# EAGLE design SensorNodeCat (EAGLE 9.6.2)
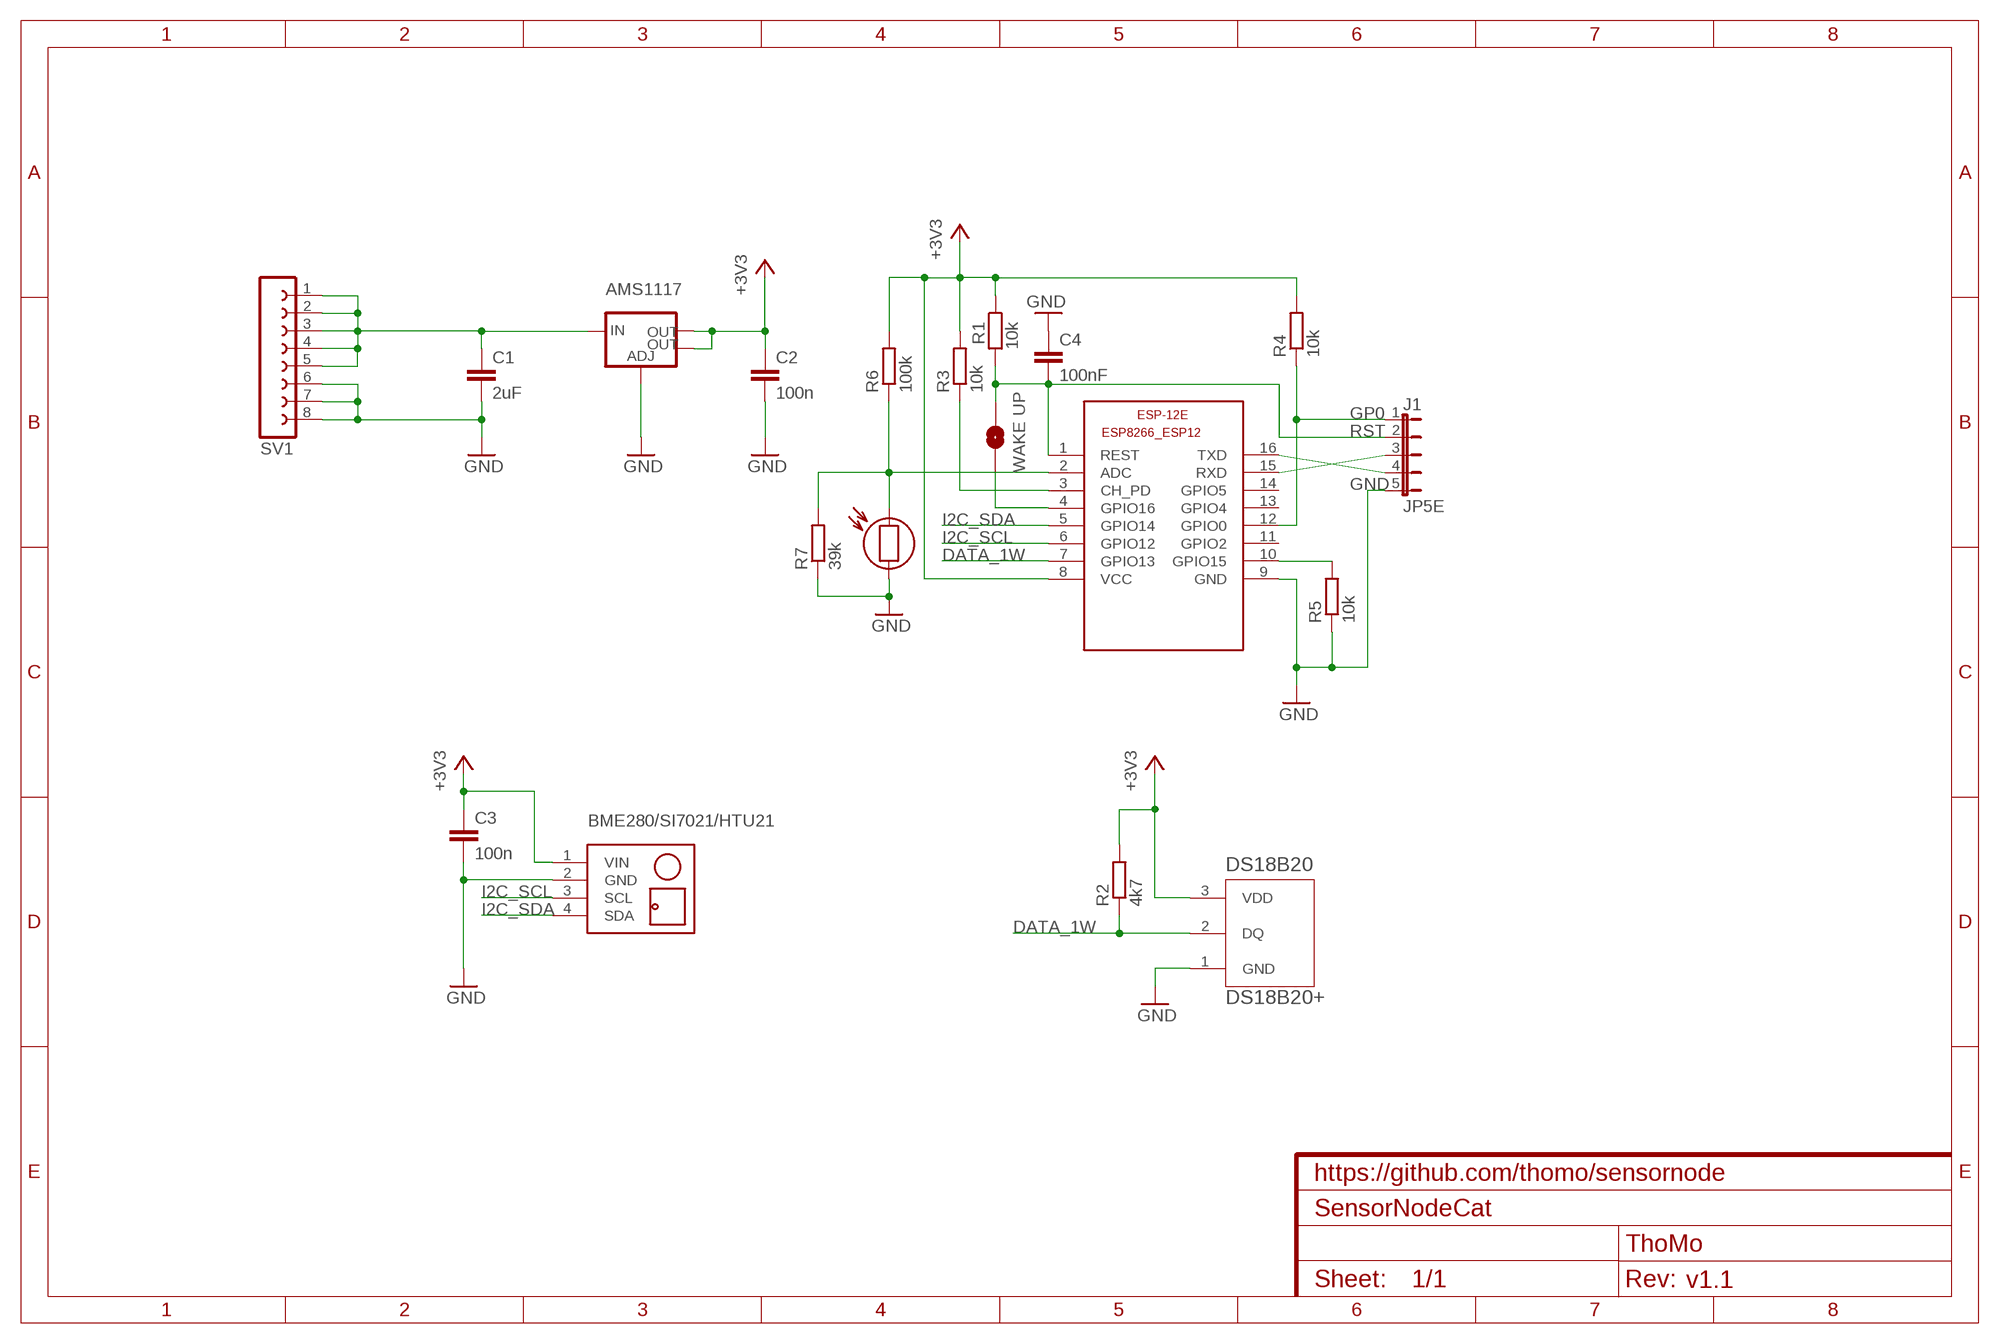
[diagram p0: schematic, sheet 1]
FRAME2 (FRAME-A4L): CNAME: https://github.com/thomo/sensornode; CREVISION: v1.1; DESIGNER: ThoMo

## Parts
AMS1117  V_REG_LM1117SOT223  [SOT223]
BME280/SI7021/HTU21  BME280  [BME280]
C1  2uF  C-EUC1206  [C1206]
C2  100n  C-EUC1206  [C1206]
C3  100n  C-EUC1206K  [C1206K]
C4  100nF  C-EUC1206  [C1206]
DS18B20  DS18B20+  [TO-92]
ESP-12E  ESP8266-12  [ESP8266-ESP12]
J1  JP5E  [JP5]
LDR  LDR-GL55XX  [GL55]
R1  10k  R-EU_M1206  [M1206]
R2  4k7  R-EU_M1206  [M1206]
R3  10k  R-EU_M1206  [M1206]
R4  10k  R-EU_M1206  [M1206]
R5  10k  R-EU_M1206  [M1206]
R6  100k  R-EU_M1206  [M1206]
R7  39k  R-EU_M1206  [M1206]
SV1  FE08-1  [FE08]
WAKEUP  WAKE UP  JUMPER-SMT_2_NO_SILK  [SMT-JUMPER_2_NO_SILK]

## Nets
+3V3: AMS1117.2(OUT) AMS1117.4(OUT) BME280/SI7021/HTU21.1(VIN) C2.1 C3.1 DS18B20.3(VDD) ESP-12E.8(VCC) R1.1 R2.2 R3.2 R4.2 R6.2
DATA_1W: DS18B20.2(DQ) ESP-12E.7(GPIO13) R2.1
GND: AMS1117.1(ADJ) BME280/SI7021/HTU21.2(GND) C1.2 C2.2 C3.2 C4.1 DS18B20.1(GND) ESP-12E.9(GND) J1.5 LDR.2 R5.1 R7.1 SV1.6 SV1.7 SV1.8
GP0: ESP-12E.12(GPIO0) J1.1 R4.1
I2C_SCL: BME280/SI7021/HTU21.3(SCL) ESP-12E.6(GPIO12)
I2C_SDA: BME280/SI7021/HTU21.4(SDA) ESP-12E.5(GPIO14)
N$1: ESP-12E.15(RXD) J1.3
N$2: ESP-12E.4(GPIO16) WAKEUP.1
N$3: ESP-12E.3(CH_PD) R3.1
N$4: ESP-12E.16(TXD) J1.4
N$5: ESP-12E.2(ADC) LDR.1 R6.1 R7.2
N$8: AMS1117.3(IN) C1.1 SV1.1 SV1.2 SV1.3 SV1.4 SV1.5
N$9: ESP-12E.10(GPIO15) R5.2
RST: C4.2 ESP-12E.1(REST) J1.2 R1.2 WAKEUP.2
Unconnected: ESP-12E.11(GPIO2) ESP-12E.13(GPIO4) ESP-12E.14(GPIO5)

## Library data of the parts
AMS1117 = SparkFun-IC-Power:V_REG_LM1117: Voltage Regulator LM1117 Standard adjustable voltage regulator but in SMD form. Spark Fun Electronics SKU : COM-00595; PROD_ID: VREG-08170
BME280/SI7021/HTU21 = thomo:BME280: Digital Humidity-Temperature-Pressure Sensor based on BME280 device More information about BME280 device is available here: https://www.bosch-sensortec.com/bst/products/all_products/bme280 Click here to find device on ebay.com <http://www.ebay.com/sch/bme280+breakout>
C1-C4 = rcl:C-EU: CAPACITOR, European symbol; SPICEPREFIX: C
DS18B20 = thomo:DS18B20+: 1wire Temp Sensor; MANUFACTURER_PART_NUMBER: DS18B20+; VENDOR: Maxim Integrated Products
ESP-12E = ESP8266-ESP12E:ESP8266-12: ESP8266-12
J1 = thomo:JP5E: 5pin connector
LDR = thomo:LDR-GL55XX: LDR GL55xx (size: 5.2x4.4 mm, pin dist: 3 mm)
R1-R7 = rcl:R-EU_: RESISTOR, European symbol; SPICEPREFIX: R
SV1 = con-lsta:FE08-1: FEMALE HEADER; OC_FARNELL: unknown; OC_NEWARK: unknown
WAKEUP = SparkFun-Jumpers:JUMPER-SMT_2_NO: Normally open jumper This jumper has two pads in close proximity to each other. Apply solder to close the connection. Round pads are easier to solder for beginners, but are a lot larger. SparkFun Product that uses the round pads: SparkFun EL Sequencer <https://www.sparkfun.com/products/12781>

## Board
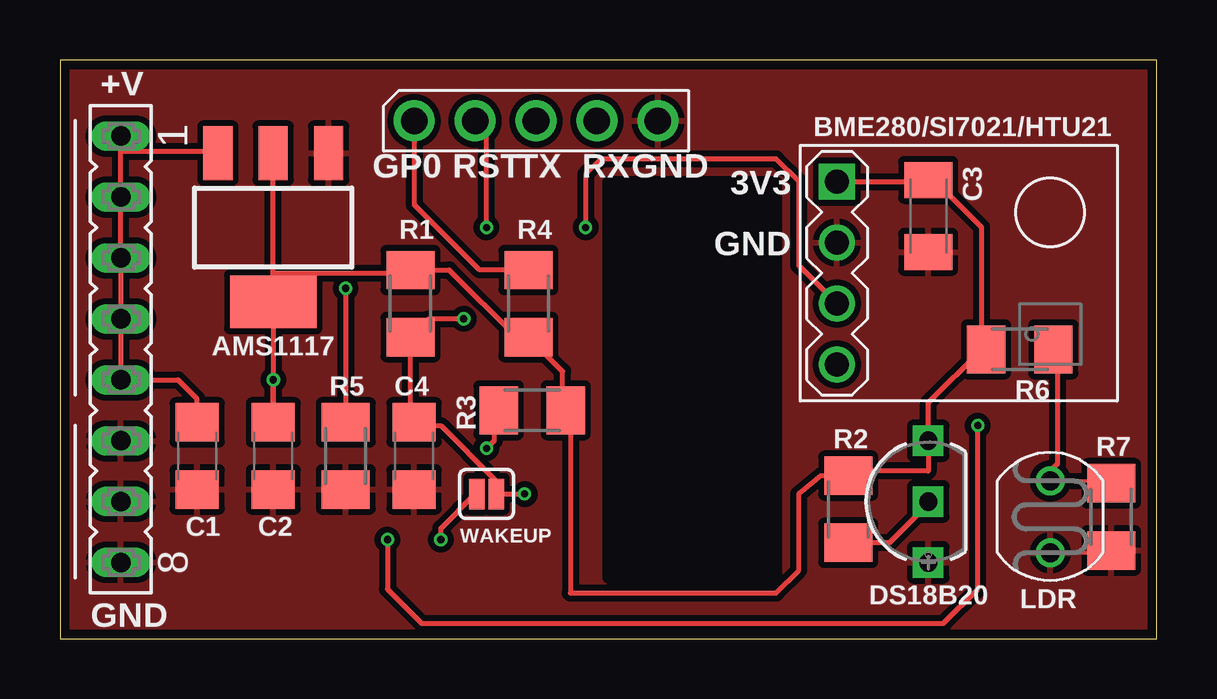
[diagram p1: board, top side]
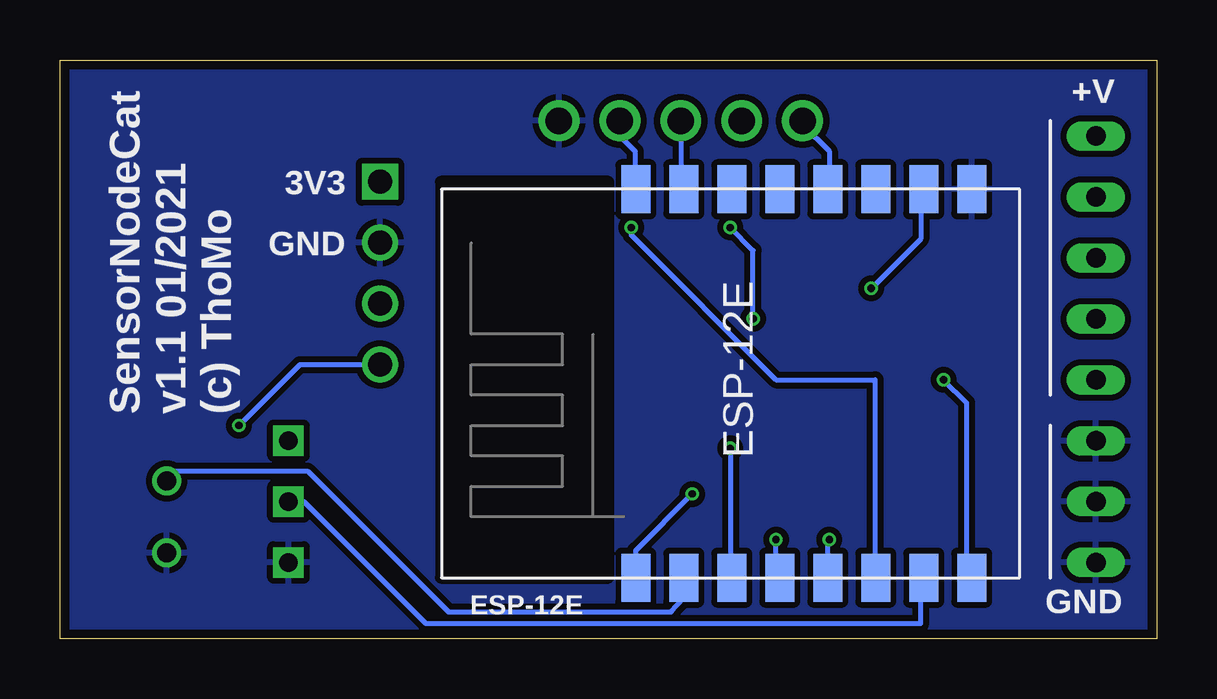
[diagram p2: board, bottom side, seen from below]

Size 45.72 x 24.13 mm. Coordinates in mm from the lower left corner, seen from the top.
Outline: 0,17.14 0,5.71
Outline: 0,0 45.72,0 45.72,24.13 0,24.13 0,0
Copper layers (1*16): Top 0.035559375mm / dielectric 1.6mm / Bottom 0.035559375mm
Design rules "oshpark-2layer": minimum track width 6mil, minimum drill 10mil, track to track 6mil, track to pad 6mil, pad to pad 6mil, via to via 6mil, smd to smd 6mil, copper to edge 15mil, drill to drill 6mil, minimum pad ring 5mil, minimum via ring 5mil, stop-mask expansion 2.5mil, vias tented up to drill 0mil, thermal gap 10mil

### Footprints (pad centres in the part's own frame; a part is rotated, then mirrored left to right if it is on the bottom)
SOT223 = smd 1.219 x 2.235: 1 -2.311,-3.099; 2 0,-3.099; 3 2.311,-3.099 | smd 3.6 x 2.2: 4 0,3.099
BME280 = drill 1 square: 1 -5.08,3.81 | drill 1: 2 -5.08,1.27; 3 -5.08,-1.27; 4 -5.08,-3.81
C1206 = smd 1.6 x 1.8: 1 -1.4,0; 2 1.4,0
C1206K = smd 1.5 x 2: 1 -1.5,0; 2 1.5,0
TO-92 = drill 0.762 pad 1.27 square: 1 -5.08,0; 2 -2.54,0; 3 0,0
ESP8266-ESP12 = smd 2 x 1.2: 1 -7.62,5.84; 2 -7.62,3.84; 3 -7.62,1.84; 4 -7.62,-0.16; 5 -7.62,-2.16; 6 -7.62,-4.16; 7 -7.62,-6.16; 8 -7.62,-8.16; 9 8.58,-8.16; 10 8.58,-6.16; 11 8.58,-4.16; 12 8.58,-2.16; 13 8.58,-0.16; 14 8.58,1.84; 15 8.58,3.84; 16 8.58,5.84
JP5 = drill 1.105 pad 1.705: 1 0,0; 2 2.54,0; 3 5.08,0; 4 7.62,0; 5 10.16,0
GL55 = drill 0.8: 1 -1.5,0; 2 1.5,0
M1206 = smd 1.6 x 2: 1 -1.4,0; 2 1.4,0
FE08 = drill 0.813 long: 1 -8.89,0; 2 -6.35,0; 3 -3.81,0; 4 -1.27,0; 5 1.27,0; 6 3.81,0; 7 6.35,0; 8 8.89,0
SMT-JUMPER_2_NO_SILK = smd 0.635 x 1.27: 1 -0.406,0; 2 0.406,0

### Placement (x,y rotation side)
AMS1117  8.89,17.14 180 top
BME280/SI7021/HTU21  37.47,15.24 0 top
C1  5.71,7.62 270 top
C2  8.89,7.62 270 top
C3  36.2,17.62 270 top
C4  14.76,7.62 90 top
DS18B20  36.2,8.26 90 top
ESP-12E  15.88,10.16 90 bottom
J1  14.76,21.59 0 top
LDR  41.27,5.08 270 top
R1  14.61,13.97 270 top
R2  32.86,5.4 90 top
R3  19.68,9.53 0 top
R4  19.53,13.97 270 top
R5  11.91,7.62 90 top
R6  40.01,12.06 180 top
R7  43.81,5.08 90 top
SV1  2.54,12.06 270 top
WAKEUP  17.78,6.03 0 top

### Tracks (layer width: path | path; a pad name or v marks a point on that pad's centre or on a via)
+3V3  (via drill 0.3)
  Top 0.203: BME280/SI7021/HTU21.1 36.07,19.05 C3.1 36.99,18.57 38.42,17.14 38.42,12.06 | 38.42,12.06 36.2,9.84 DS18B20.3 36.2,6.99 33.02,6.99 R2.2 31.73,6.8 30.8,6.03 30.8,2.86 29.84,1.91 21.27,1.91 21.27,9.53 R3.2 20.95,9.53 20.95,11.14 R4.2 19.02,12.57 16.22,15.37 R1.1 14.61,15.24 8.89,15.24 | 38.42,12.06 R6.2 | v8.89,10.79 C2.1 AMS1117.4 8.89,15.24 | 8.89,15.24 AMS1117.2
  Bottom 0.203: v8.89,10.79 7.94,9.84 7.94,2.54 ESP-12E.8
DATA_1W
  Top 0.203: DS18B20.2 36.2,5.61 34.58,4 R2.1
  Bottom 0.203: DS18B20.2 35.56,5.71 30.48,0.64 9.84,0.64 9.84,2.22 ESP-12E.7
GND
  Top 0.152: R7.1 43.72,3.58 LDR.2
  pour Top (isolate 0.254): 0,24.13 0,0 45.88,0 45.88,24.13
  pour Bottom (isolate 0.254): 0,24.13 0,0 45.88,0 45.88,24.13
GP0
  Top 0.203: R4.1 17.49,15.37 14.76,18.1 J1.1
  Bottom 0.203: J1.1 14.76,21.43 13.65,20.32 13.65,19.05 ESP-12E.12
I2C_SCL  (via drill 0.3)
  Top 0.203: BME280/SI7021/HTU21.3 30.8,15.56 30.8,19.05 29.84,20 22.54,20 21.91,19.37 v21.91,17.14
  Bottom 0.203: ESP-12E.6 11.75,2.54 11.75,10.79 15.88,10.79 21.91,16.83 v21.91,17.14
I2C_SDA  (via drill 0.3)
  Top 0.203: v38.26,8.89 38.26,2.06 36.83,0.64 15.08,0.64 13.65,2.06 v13.65,4.13
  Bottom 0.203: ESP-12E.5 13.71,4.07 v13.65,4.13 | v38.26,8.89 35.72,11.43 BME280/SI7021/HTU21.4
N$1
  Bottom 0.203: ESP-12E.15 19.84,18.87 J1.3
N$2  (via drill 0.3)
  Top 0.203: v15.88,4.13 15.88,4.6 17.3,6.03 WAKEUP.1
  Bottom 0.203: v15.88,4.13 15.88,2.54 ESP-12E.4
N$3  (via drill 0.3)
  Top 0.203: v17.78,7.94 18.1,8.26 18.1,9.53 R3.1
  Bottom 0.203: v17.78,7.94 17.78,2.54 ESP-12E.3
N$4
  Bottom 0.203: ESP-12E.16 21.75,18.74 21.75,20.32 22.38,20.95 J1.4
N$5
  Top 0.152: LDR.1 43.72,6.58 R7.2
  Top 0.203: LDR.1 41.27,6.99 41.59,7.3 41.59,12.06 R6.1
  Bottom 0.203: ESP-12E.2 19.71,1.7 20.25,1.11 29.53,1.11 35.4,6.99 40.96,6.99 41.27,6.67 LDR.1
N$8
  Top 0.203: 2.54,20.32 6.35,20.32 AMS1117.3 | C1.1 5.71,10 4.92,10.79 SV1.5 SV1.4 SV1.3 SV1.2 2.54,20.32 | 2.54,20.32 SV1.1
N$9  (via drill 0.3)
  Top 0.203: v11.91,14.61 R5.2
  Bottom 0.203: v11.91,14.61 9.84,16.67 9.84,18.73 ESP-12E.10
RST  (via drill 0.3)
  Top 0.203: v19.37,6.03 WAKEUP.2 18.1,6.03 18.1,6.67 15.88,8.89 14.92,8.89 C4.2 14.61,9.21 R1.2 15.37,13.34 v16.83,13.34 | v17.78,17.14 17.78,21.11 J1.2
  Bottom 0.203: ESP-12E.1 21.71,3.69 v19.37,6.03 | v16.83,13.34 16.83,16.19 v17.78,17.14

### Text on the board
tNames: +V | 3V3 | GP0 | RST | TX | RX | GND | GND | GND
bNames: +V | 3V3 | GND | SensorNodeCat / v1.1 01/2021 / (c) ThoMo | GND